# EAGLE design Enclosure 100x68 WS (EAGLE 9.6.2)
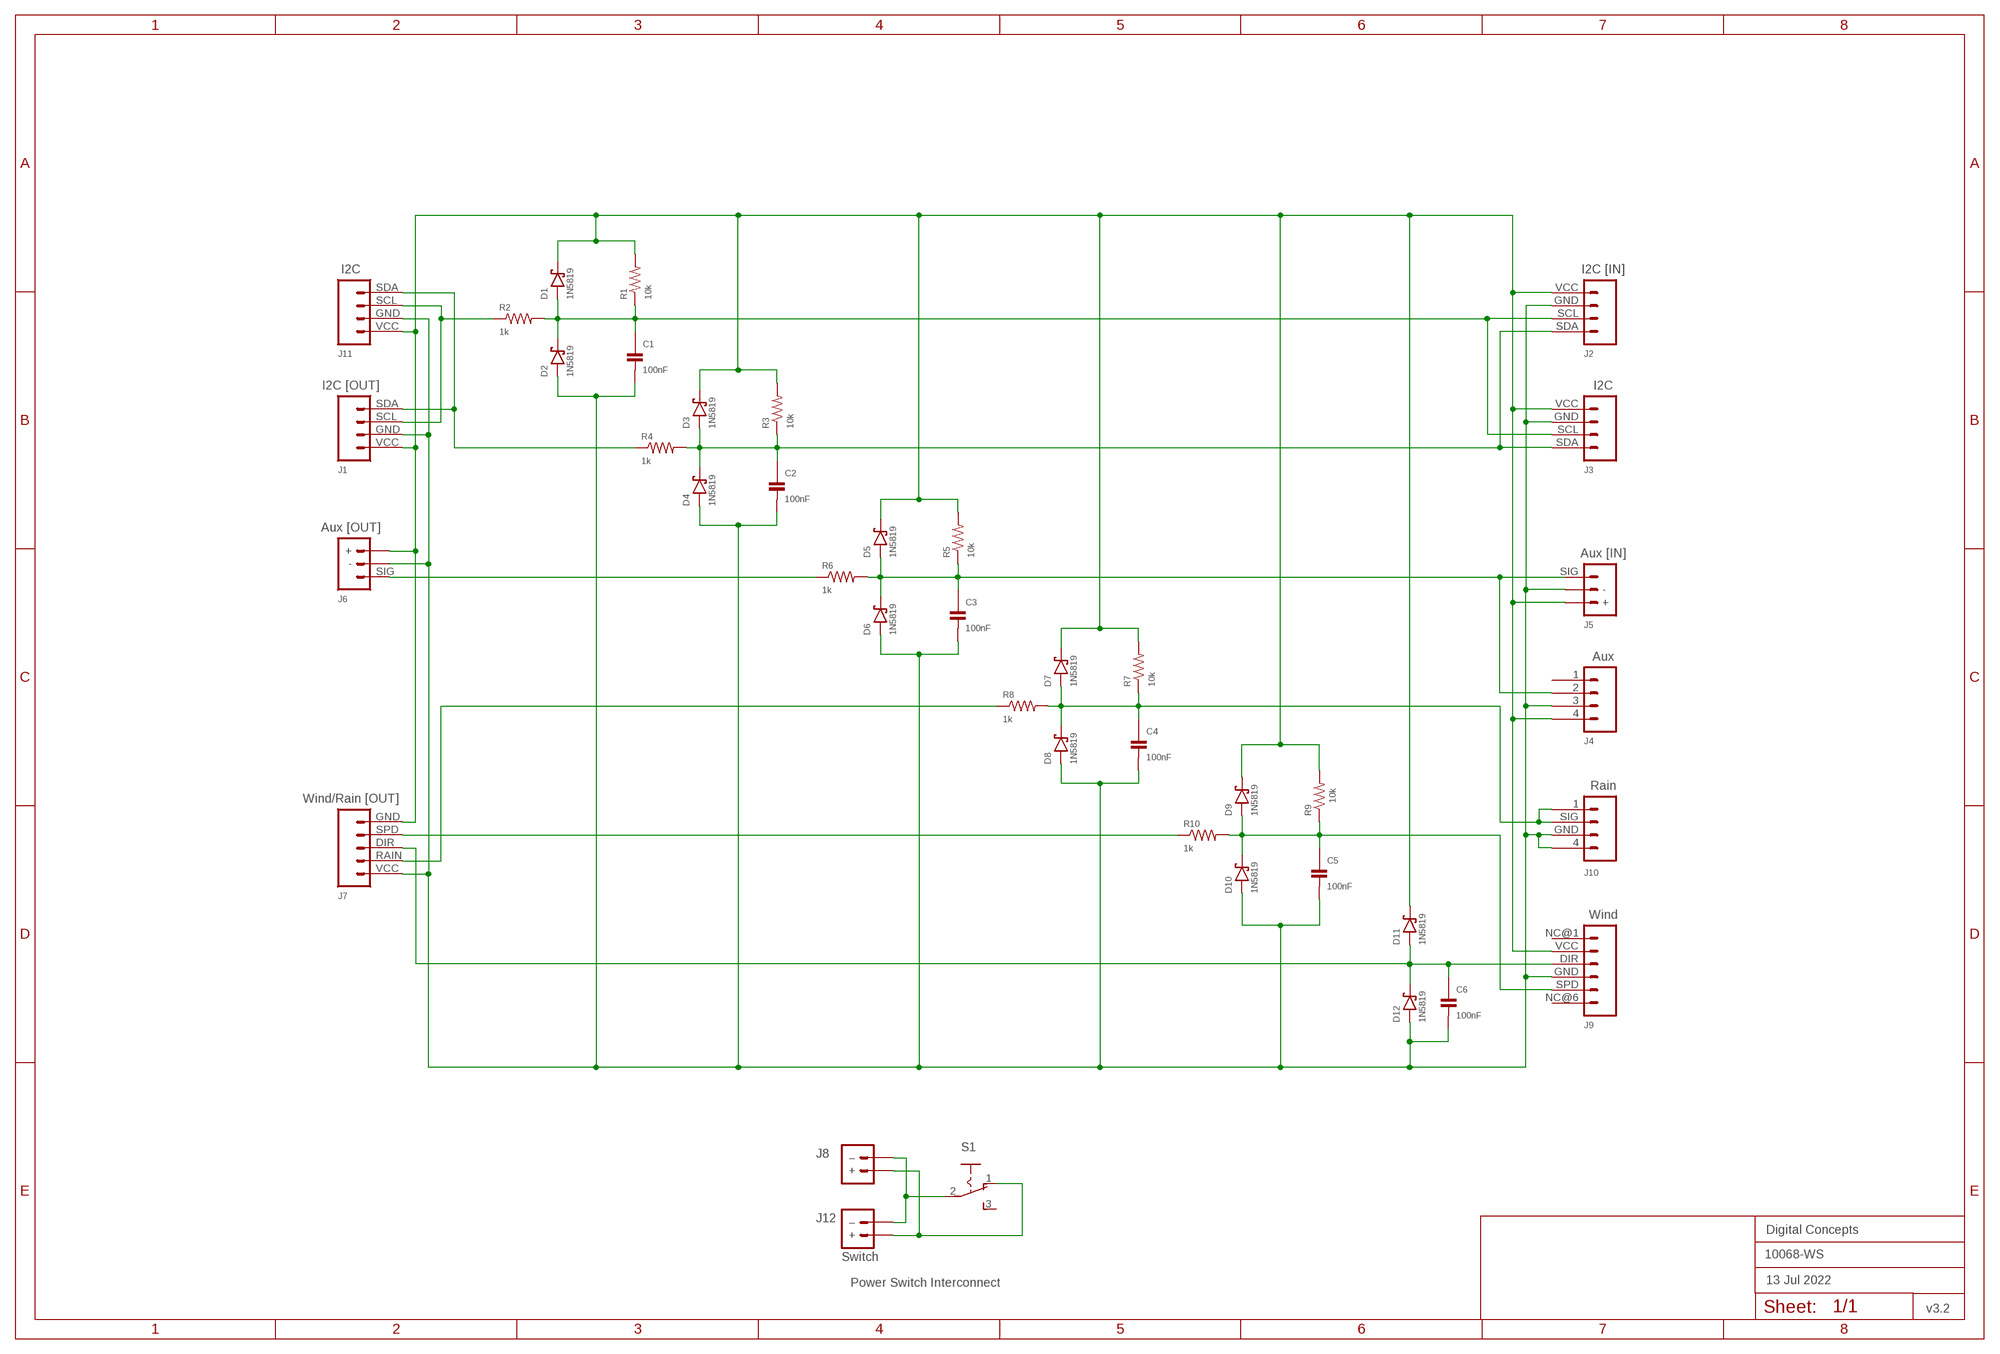
[diagram p0: schematic, sheet 1]
FRAME2 (A3L-LOC): DATE: 13 Jul 2022; OWNER: Digital Concepts; TITLE: 10068-WS; VERSION: v3.2

## Parts
C1  100nF  CAPACITOR-0805  [C0805]
C2  100nF  CAPACITOR-0805  [C0805]
C3  100nF  CAPACITOR-0805  [C0805]
C4  100nF  CAPACITOR-0805  [C0805]
C5  100nF  CAPACITOR-0805  [C0805]
C6  100nF  CAPACITOR-0805  [C0805]
D1  1N5819  DIODE-SCHOTTKY-1N5819  [SOD-123]
D2  1N5819  DIODE-SCHOTTKY-1N5819  [SOD-123]
D3  1N5819  DIODE-SCHOTTKY-1N5819  [SOD-123]
D4  1N5819  DIODE-SCHOTTKY-1N5819  [SOD-123]
D5  1N5819  DIODE-SCHOTTKY-1N5819  [SOD-123]
D6  1N5819  DIODE-SCHOTTKY-1N5819  [SOD-123]
D7  1N5819  DIODE-SCHOTTKY-1N5819  [SOD-123]
D8  1N5819  DIODE-SCHOTTKY-1N5819  [SOD-123]
D9  1N5819  DIODE-SCHOTTKY-1N5819  [SOD-123]
D10  1N5819  DIODE-SCHOTTKY-1N5819  [SOD-123]
D11  1N5819  DIODE-SCHOTTKY-1N5819  [SOD-123]
D12  1N5819  DIODE-SCHOTTKY-1N5819  [SOD-123]
J1  I2C [OUT]  JST-PH2.0-4-DUAL-I2C  [JST-PH2.0-4-DUAL-I2C]
J2  I2C [IN]  JST-PH2.0-4-VERTICAL-I2C  [JST-PH2.0-4-VERTICAL-I2C]
J3  I2C  RJ11-6P4C-VERTICAL-I2C  [RJ11-4-VERTICAL-I2C]
J4  Aux  RJ11-6P4C-VERTICAL  [RJ11-4-VERTICAL]
J5  Aux [IN]  JST-PH2.0-3-VERTICAL-SIG  [JST-PH2.0-3-VERTICAL-SIG]
J6  Aux [OUT]  JST-PH2.0-3-DUAL-SIG  [JST-PH2.0-3-DUAL-SIG]
J7  Wind/Rain [OUT]  JST-PH2.0-5-DUAL-WEATHER  [JST-PH2.0-5-DUAL-WEATHER]
J8  Switch  JST-PH2.0-2-VERTICAL-POWER  [JST-PH2.0-2-VERTICAL=POWER]
J9  Wind  RJ11-6P6C-VERTICAL-WIND  [RJ11-6-VERTICAL-WIND]
J10  Rain  RJ11-6P4C-VERTICAL-RAIN  [RJ11-4-VERTICAL-RAIN]
J11  I2C  HEADER-1X4-I2C  [CONN_04-I2C]
J12  Switch  JST-PH2.0-2-HORIZONTAL-POWERJST-PTH-2  [JST-PH2.0-2-HORIZONTAL-POWER]
R1  10k  RESISTORR0805  [R0805]
R2  1k  RESISTORR0805  [R0805]
R3  10k  RESISTORR0805  [R0805]
R4  1k  RESISTORR0805  [R0805]
R5  10k  RESISTORR0805  [R0805]
R6  1k  RESISTORR0805  [R0805]
R7  10k  RESISTORR0805  [R0805]
R8  1k  RESISTORR0805  [R0805]
R9  10k  RESISTORR0805  [R0805]
R10  1k  RESISTORR0805  [R0805]
S1  SWITCH-SLIDE-SPDT  [SWITCH-SPDT-PTH]

## Nets
GND: C1.2 C2.2 C3.2 C4.2 C5.2 C6.2 D2.A D4.A D6.A D8.A D10.A D12.A J1.GND J2.GND J3.GND J4.3 J5.- J6.- J7.VCC J9.GND J10.4 J10.GND J11.GND
N$1: J7.RAIN R8.1
N$2: J1.SCL J11.SCL R2.1
N$3: J1.SDA J11.SDA R4.1
N$4: C6.1 D11.A D12.C J7.DIR J9.DIR
N$5: J7.SPD R10.1
N$7: C4.1 D7.A D8.C J10.1 J10.SIG R7.1 R8.2
N$8: C2.1 D3.A D4.C J2.SDA J3.SDA R3.1 R4.2
N$9: J6.SIG R6.1
N$11: C1.1 D1.A D2.C J2.SCL J3.SCL R1.1 R2.2
N$14: J8.-(–) J12.-(–) S1.2(P)
N$15: C3.1 D5.A D6.C J4.2 J5.SIG R5.1 R6.2
N$16: J8.+ J12.+ S1.1(O)
N$29: C5.1 D9.A D10.C J9.SPD R9.1 R10.2
VCC: D1.C D3.C D5.C D7.C D9.C D11.C J1.VCC J2.VCC J3.VCC J4.4 J5.+ J6.+ J7.GND J9.VCC J11.VCC R1.2 R3.2 R5.2 R7.2 R9.2
Unconnected: J4.1 J9.NC@1 J9.NC@6 S1.3(S)

## Notes on the sheet
- Power Switch Interconnect

## Library data of the parts
C1-C6 = digitalconcepts:CAPACITOR-0805: 0805 Capacitor
D1-D12 = digitalconcepts:DIODE-SCHOTTKY-1N5819: 1N5819 Schottky Diode SOD-123
J1 = digitalconcepts:JST-PH2.0-4-DUAL-I2C: PH2.0 4P I2C Dual Connector
J2 = digitalconcepts:JST-PH2.0-4-VERTICAL-I2C: PH2.0 4P I2C Vertical Connector
J3 = digitalconcepts:RJ11-6P4C-VERTICAL-I2C: RJ11-6P4C-Vertical PCB Socket
J4 = digitalconcepts:RJ11-6P4C-VERTICAL: RJ11-6P4C-Vertical PCB Socket
J5 = digitalconcepts:JST-PH2.0-3-VERTICAL-SIG: PH2.0 3P Vertical Connector (Sig)
J6 = digitalconcepts:JST-PH2.0-3-DUAL-SIG: PH2.0 3P Dual Sig Horizontal on top, vertical on bottom
J7 = digitalconcepts:JST-PH2.0-5-DUAL-WEATHER: PH2.0 5P Dual Connector
J8 = digitalconcepts:JST-PH2.0-2-VERTICAL-POWER: JST PH2.0 2P PTH Connector (Power)
J9 = digitalconcepts:RJ11-6P6C-VERTICAL-WIND: RJ11-6P6C-Vertical PCB Socket
J10 = digitalconcepts:RJ11-6P4C-VERTICAL-RAIN: RJ11-6P4C-Vertical PCB Socket
J11 = digitalconcepts:HEADER-1X4-I2C: I2C Interface [Pin 1 Vcc] 4-Pin Header
J12 = digitalconcepts:JST-PH2.0-2-HORIZONTAL-POWER: PH2.0 2P Right Angle PCB Connector; PROD_ID: CONN-09863; SKU: PRT-09914
R1-R10 = digitalconcepts:RESISTOR: Resistor; SPICEPREFIX: R
S1 = digitalconcepts:SWITCH-SLIDE-SPDT: Mini Sliding Switch SPDT

## Board
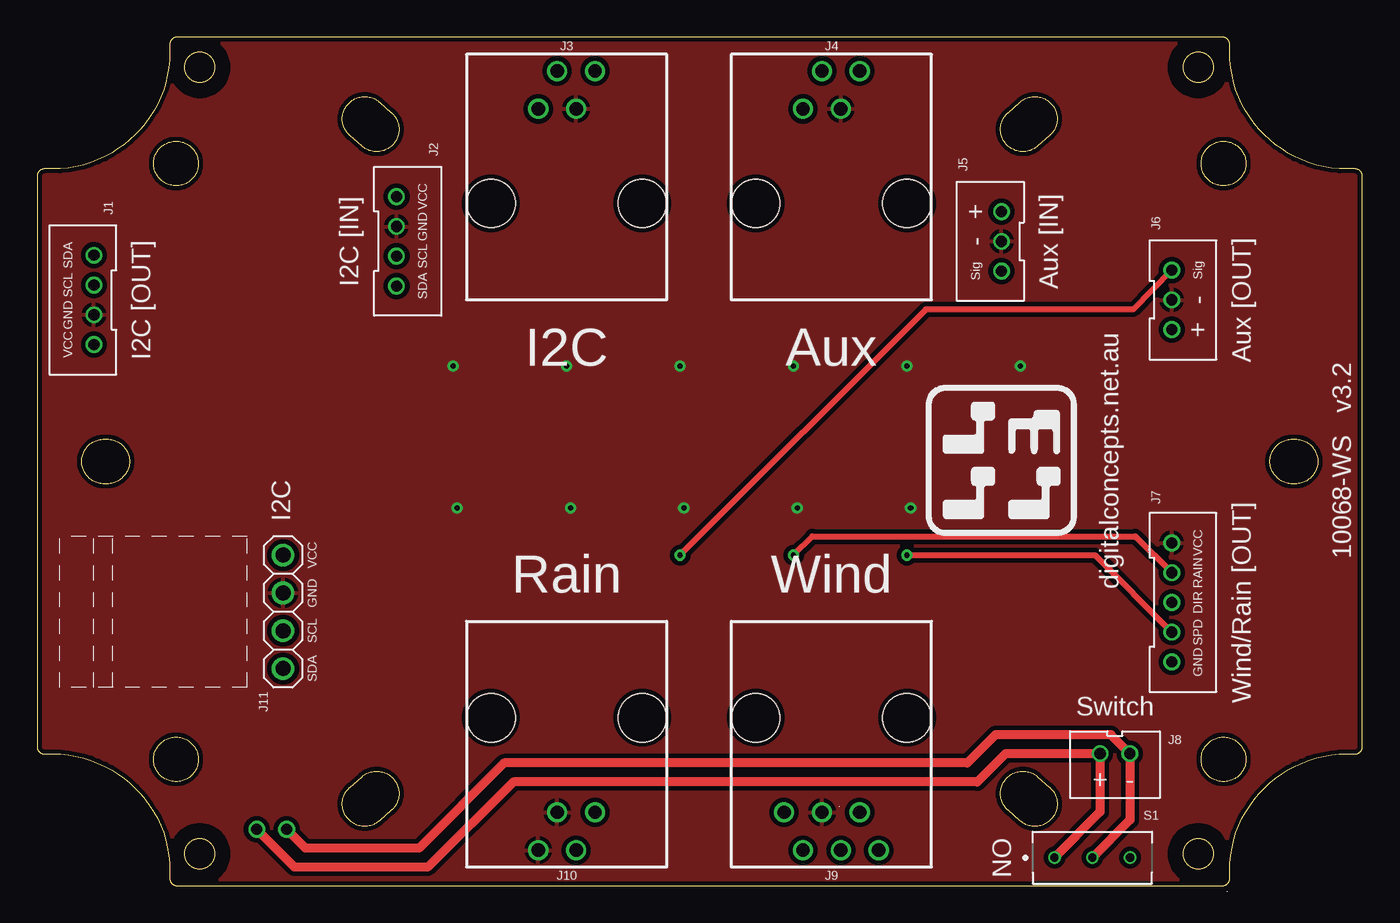
[diagram p1: board, top side]
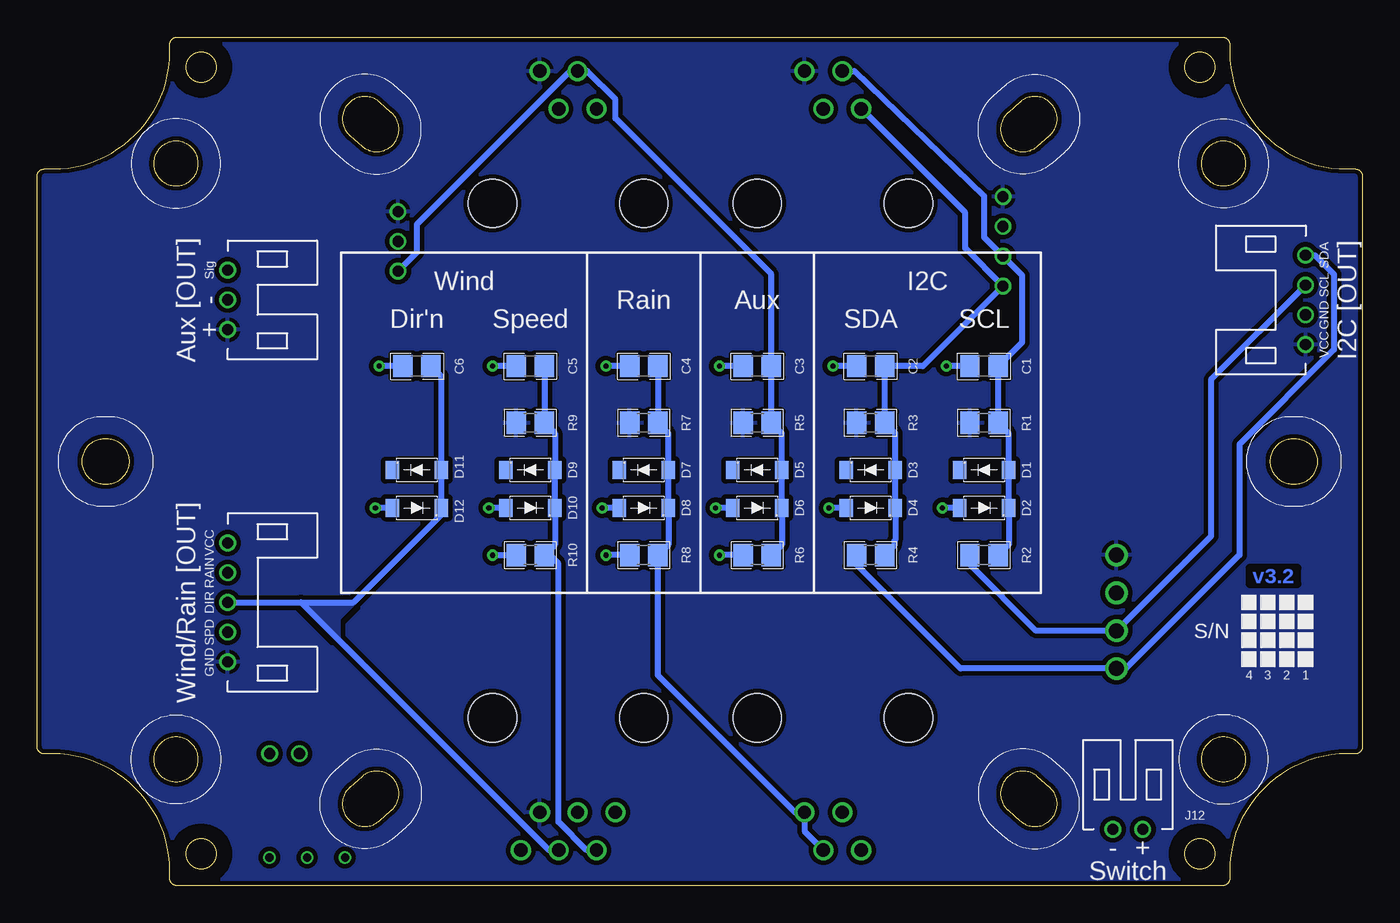
[diagram p2: board, bottom side, seen from below]

Size 89 x 57 mm. Coordinates in mm from the lower left corner, seen from the top.
Outline: 65.22,5.06 66.02,4.36 66.02,4.36 66.06,4.32 66.11,4.28 66.17,4.24 66.25,4.19 66.33,4.14 66.42,4.11 66.51,4.07 66.6,4.04 66.7,4.02 66.8,4 66.9,3.99 67.11,3.99 67.21,4 67.31,4.02 67.4,4.04 67.5,4.07 67.59,4.11 67.68,4.14 67.76,4.19 67.84,4.24 67.92,4.3 68,4.36 68.07,4.43 68.13,4.49 68.19,4.57 68.25,4.65 68.3,4.73 68.35,4.81 68.39,4.9 68.42,4.99 68.45,5.09 68.47,5.19 68.49,5.28 68.5,5.38 68.5,5.59 68.49,5.69 68.47,5.79 68.45,5.89 68.42,5.98 68.39,6.07 68.35,6.16 68.3,6.25 68.25,6.33 68.19,6.41 68.13,6.48 68.07,6.55 68.04,6.57 68.02,6.59 67.99,6.62 67.99,6.62 67.19,7.32 67.19,7.32 67.14,7.36 67.09,7.4 67.04,7.43 66.96,7.49 66.88,7.53 66.79,7.57 66.7,7.61 66.6,7.64 66.51,7.66 66.41,7.68 66.31,7.69 66.1,7.69 66,7.68 65.9,7.66 65.8,7.64 65.71,7.61 65.62,7.57 65.53,7.53 65.45,7.49 65.37,7.43 65.29,7.38 65.21,7.32 65.14,7.25 65.08,7.18 65.01,7.11 64.96,7.03 64.91,6.95 64.86,6.86 64.82,6.77 64.78,6.68 64.75,6.59 64.74,6.49 64.72,6.39 64.7,6.29 64.7,6.08 64.72,5.98 64.74,5.89 64.75,5.79 64.78,5.69 64.82,5.6 64.86,5.51 64.91,5.43 64.96,5.35 65.01,5.27 65.08,5.2 65.17,5.1 65.19,5.08 65.22,5.06
Outline: 65.22,5.06 65.22,5.06
Outline: 65.22,51.94 65.19,51.92 65.17,51.9 65.14,51.87 65.08,51.8 65.01,51.73 64.96,51.65 64.91,51.57 64.86,51.49 64.82,51.4 64.78,51.31 64.75,51.21 64.73,51.11 64.71,51.02 64.7,50.92 64.7,50.71 64.71,50.61 64.73,50.51 64.75,50.41 64.78,50.32 64.82,50.23 64.86,50.14 64.91,50.05 64.96,49.97 65.01,49.89 65.08,49.82 65.14,49.75 65.21,49.68 65.29,49.62 65.37,49.57 65.45,49.51 65.53,49.47 65.62,49.43 65.71,49.39 65.8,49.36 65.9,49.34 66,49.32 66.1,49.31 66.31,49.31 66.41,49.32 66.51,49.34 66.6,49.36 66.7,49.39 66.79,49.43 66.88,49.47 66.96,49.51 67.04,49.57 67.09,49.6 67.14,49.64 67.19,49.68 67.19,49.68 67.99,50.38 67.99,50.38 68.02,50.41 68.04,50.43 68.07,50.45 68.13,50.52 68.19,50.59 68.25,50.67 68.3,50.75 68.35,50.84 68.39,50.93 68.42,51.02 68.45,51.11 68.47,51.21 68.49,51.31 68.5,51.41 68.5,51.62 68.49,51.72 68.45,51.91 68.42,52.01 68.39,52.1 68.35,52.19 68.3,52.27 68.25,52.35 68.19,52.43 68.13,52.51 68.07,52.57 68,52.64 67.92,52.7 67.84,52.76 67.76,52.81 67.68,52.86 67.59,52.89 67.5,52.93 67.4,52.96 67.31,52.98 67.21,53 67.11,53.01 66.9,53.01 66.8,53 66.7,52.98 66.6,52.96 66.51,52.93 66.42,52.89 66.33,52.86 66.25,52.81 66.17,52.76 66.11,52.72 66.06,52.68 66.02,52.64 66.02,52.64 65.22,51.94
Outline: 65.22,51.94 65.22,51.94
Outline: 23.78,5.06 23.81,5.08 23.83,5.1 23.86,5.13 23.92,5.2 23.99,5.27 24.04,5.35 24.09,5.43 24.14,5.51 24.18,5.6 24.22,5.69 24.25,5.79 24.27,5.89 24.29,5.98 24.3,6.08 24.3,6.29 24.29,6.39 24.27,6.49 24.25,6.59 24.22,6.68 24.18,6.77 24.14,6.86 24.09,6.95 24.04,7.03 23.99,7.11 23.92,7.18 23.86,7.25 23.79,7.32 23.71,7.38 23.63,7.43 23.55,7.49 23.47,7.53 23.38,7.57 23.29,7.61 23.2,7.64 23.1,7.66 23,7.68 22.9,7.69 22.69,7.69 22.59,7.68 22.49,7.66 22.4,7.64 22.3,7.61 22.21,7.57 22.12,7.53 22.04,7.49 21.96,7.43 21.91,7.4 21.86,7.36 21.81,7.32 21.81,7.32 21.01,6.62 21.01,6.62 20.98,6.59 20.96,6.57 20.94,6.55 20.87,6.48 20.81,6.41 20.75,6.33 20.7,6.25 20.65,6.16 20.61,6.07 20.58,5.98 20.55,5.89 20.53,5.79 20.51,5.69 20.5,5.59 20.5,5.38 20.51,5.28 20.53,5.18 20.55,5.09 20.58,4.99 20.61,4.9 20.65,4.81 20.7,4.73 20.75,4.65 20.81,4.57 20.87,4.49 20.94,4.43 21,4.36 21.08,4.3 21.16,4.24 21.24,4.19 21.32,4.14 21.41,4.11 21.5,4.07 21.6,4.04 21.69,4.02 21.79,4 21.89,3.99 22.1,3.99 22.2,4 22.3,4.02 22.4,4.04 22.49,4.07 22.58,4.11 22.67,4.14 22.75,4.19 22.83,4.24 22.89,4.28 22.94,4.32 22.98,4.36 22.98,4.36 23.78,5.06
Outline: 23.78,5.06 23.78,5.06
Outline: 21.01,50.38 21.81,49.68 21.81,49.68 21.86,49.64 21.91,49.6 21.96,49.57 22.04,49.51 22.12,49.47 22.21,49.43 22.3,49.39 22.4,49.36 22.49,49.34 22.59,49.32 22.69,49.31 22.9,49.31 23,49.32 23.1,49.34 23.2,49.36 23.29,49.39 23.38,49.43 23.47,49.47 23.56,49.51 23.64,49.57 23.71,49.62 23.79,49.68 23.86,49.75 23.93,49.82 23.99,49.89 24.04,49.97 24.09,50.05 24.14,50.14 24.18,50.23 24.22,50.32 24.25,50.41 24.27,50.51 24.29,50.61 24.3,50.71 24.3,50.91 24.29,51.02 24.27,51.11 24.25,51.21 24.22,51.31 24.18,51.4 24.14,51.48 24.09,51.57 24.04,51.65 23.99,51.73 23.93,51.8 23.86,51.87 23.83,51.9 23.81,51.92 23.78,51.94 23.78,51.94 22.98,52.64 22.98,52.64 22.93,52.68 22.89,52.72 22.83,52.76 22.75,52.81 22.67,52.86 22.58,52.89 22.49,52.93 22.4,52.96 22.3,52.98 22.2,53 22.1,53.01 21.89,53.01 21.79,53 21.69,52.98 21.6,52.96 21.5,52.93 21.41,52.89 21.32,52.86 21.24,52.81 21.16,52.76 21.08,52.7 21,52.64 20.94,52.57 20.87,52.51 20.81,52.43 20.75,52.35 20.7,52.27 20.65,52.19 20.61,52.1 20.58,52.01 20.55,51.91 20.53,51.81 20.51,51.72 20.5,51.62 20.5,51.41 20.51,51.31 20.53,51.21 20.55,51.11 20.58,51.02 20.61,50.93 20.65,50.84 20.7,50.75 20.75,50.67 20.81,50.59 20.87,50.52 20.94,50.45 20.96,50.43 20.98,50.41 21.01,50.38
Outline: 21.01,50.38 21.01,50.38
Outline: 0.01,9.24 0.02,9.2 0.03,9.17 0.04,9.14 0.05,9.11 0.07,9.09 0.08,9.06 0.1,9.03 0.12,9.01 0.14,8.99 0.17,8.97 0.19,8.95 0.22,8.93 0.24,8.91 0.27,8.9 0.3,8.88 0.33,8.87 0.36,8.86 0.39,8.85 0.43,8.85 0.46,8.84 1.54,8.84 2.07,8.79 2.58,8.68 3.1,8.58 3.6,8.43 4.07,8.23 4.54,8.03 4.99,7.78 5.41,7.5 5.83,7.22 6.23,6.9 6.58,6.54 6.94,6.19 7.26,5.8 7.55,5.38 7.83,4.96 8.08,4.51 8.48,3.57 8.63,3.08 8.74,2.57 8.85,2.05 8.9,1.53 8.9,0.46 8.9,0.42 8.91,0.39 8.92,0.36 8.93,0.33 8.94,0.3 8.95,0.27 8.97,0.24 8.98,0.22 9,0.19 9.02,0.17 9.04,0.14 9.07,0.12 9.09,0.1 9.12,0.08 9.14,0.07 9.17,0.05 9.2,0.04 9.23,0.03 9.26,0.02 9.3,0.01 9.33,0 9.36,0 79.64,0 79.67,0 79.7,0.01 79.74,0.02 79.77,0.03 79.8,0.04 79.83,0.05 79.86,0.07 79.88,0.08 79.91,0.1 79.93,0.12 79.98,0.17 80,0.19 80.02,0.22 80.03,0.24 80.05,0.27 80.06,0.3 80.07,0.33 80.08,0.36 80.09,0.39 80.1,0.42 80.1,0.46 80.1,1.53 80.16,2.05 80.26,2.57 80.37,3.08 80.52,3.57 80.72,4.04 80.92,4.51 81.17,4.96 81.45,5.38 81.74,5.8 82.06,6.19 82.42,6.54 82.78,6.9 83.17,7.22 83.59,7.5 84.01,7.78 84.46,8.03 84.93,8.23 85.41,8.43 85.9,8.58 86.42,8.68 86.93,8.79 87.46,8.84 88.54,8.84 88.57,8.85 88.61,8.85 88.64,8.86 88.67,8.87 88.7,8.88 88.73,8.9 88.76,8.91 88.78,8.93 88.81,8.95 88.83,8.97 88.86,8.99 88.88,9.01 88.9,9.03 88.92,9.06 88.93,9.09 88.95,9.11 88.96,9.14 88.97,9.17 88.98,9.2 88.99,9.24 89,9.27 89,9.3 89,47.7 89,47.73 88.99,47.76 88.98,47.79 88.97,47.83 88.96,47.86 88.95,47.88 88.93,47.91 88.92,47.94 88.9,47.96 88.88,47.99 88.86,48.01 88.83,48.03 88.81,48.05 88.78,48.07 88.76,48.09 88.73,48.1 88.7,48.12 88.67,48.13 88.64,48.14 88.61,48.14 88.57,48.15 88.54,48.15 87.46,48.15 86.93,48.21 86.42,48.31 85.9,48.42 85.41,48.57 84.93,48.77 84.46,48.97 84.01,49.22 83.59,49.5 83.17,49.78 82.78,50.1 82.42,50.46 82.06,50.81 81.74,51.2 81.45,51.62 81.17,52.04 80.92,52.49 80.72,52.96 80.52,53.43 80.37,53.92 80.26,54.43 80.16,54.94 80.1,55.47 80.1,56.54 80.1,56.58 80.09,56.61 80.08,56.64 80.07,56.67 80.06,56.7 80.05,56.73 80.03,56.76 80.02,56.78 80,56.81 79.98,56.83 79.96,56.86 79.93,56.88 79.91,56.9 79.88,56.92 79.86,56.93 79.83,56.95 79.8,56.96 79.77,56.97 79.74,56.98 79.71,56.99 79.67,57 79.64,57 9.36,57 9.33,57 9.3,56.99 9.26,56.98 9.23,56.97 9.2,56.96 9.17,56.95 9.14,56.93 9.12,56.92 9.09,56.9 9.07,56.88 9.04,56.86 9.02,56.83 9,56.81 8.98,56.78 8.97,56.76 8.95,56.73 8.94,56.7 8.93,56.67 8.92,56.64 8.91,56.61 8.9,56.58 8.9,56.54 8.9,55.47 8.85,54.94 8.74,54.43 8.63,53.92 8.48,53.43 8.08,52.49 7.83,52.04 7.55,51.62 7.26,51.2 6.94,50.81 6.58,50.46 6.23,50.1 5.83,49.78 5.41,49.5 4.99,49.22 4.54,48.97 4.07,48.77 3.6,48.57 3.1,48.42 2.58,48.31 2.07,48.21 1.54,48.15 0.46,48.15 0.43,48.15 0.39,48.14 0.36,48.14 0.33,48.13 0.3,48.12 0.27,48.1 0.24,48.09 0.22,48.07 0.19,48.05 0.17,48.03 0.14,48.01 0.12,47.99 0.1,47.96 0.08,47.94 0.07,47.91 0.05,47.88 0.04,47.85 0.03,47.83 0.02,47.79 0.01,47.76 0,47.73 0,47.7 0,9.3 0,9.27 0.01,9.24
Outline: 82.84,28.8 82.86,28.9 82.88,28.99 82.92,29.08 82.96,29.17 83.01,29.26 83.06,29.34 83.12,29.42 83.18,29.49 83.24,29.56 83.31,29.63 83.39,29.69 83.47,29.74 83.55,29.8 83.63,29.84 83.72,29.88 83.81,29.92 83.91,29.95 84,29.97 84.1,29.99 84.2,30 84.61,30 84.71,29.99 84.81,29.97 84.91,29.95 85,29.92 85.09,29.88 85.18,29.84 85.26,29.8 85.34,29.74 85.42,29.69 85.5,29.63 85.57,29.56 85.63,29.49 85.7,29.42 85.75,29.34 85.8,29.26 85.85,29.17 85.89,29.08 85.93,28.99 85.96,28.9 85.98,28.8 85.99,28.7 86.01,28.6 86.01,28.4 85.99,28.3 85.98,28.2 85.96,28.1 85.93,28.01 85.85,27.83 85.8,27.74 85.75,27.66 85.7,27.58 85.63,27.51 85.57,27.44 85.5,27.37 85.42,27.31 85.34,27.26 85.26,27.2 85.18,27.16 85.09,27.12 85,27.08 84.91,27.05 84.81,27.03 84.71,27.01 84.61,27 84.2,27 84.1,27.01 84,27.03 83.91,27.05 83.81,27.08 83.72,27.12 83.63,27.16 83.55,27.2 83.47,27.26 83.39,27.31 83.31,27.37 83.24,27.44 83.18,27.51 83.12,27.58 83.06,27.66 83.01,27.74 82.96,27.83 82.92,27.92 82.88,28.01 82.86,28.1 82.84,28.2 82.82,28.3 82.81,28.4 82.81,28.6 82.82,28.7 82.84,28.8
Outline: 78.21,48.82 78.23,48.91 78.26,49.01 78.3,49.1 78.34,49.19 78.38,49.27 78.44,49.35 78.49,49.43 78.55,49.51 78.62,49.58 78.69,49.64 78.76,49.7 78.84,49.76 78.92,49.81 79.01,49.86 79.1,49.9 79.19,49.94 79.28,49.96 79.38,49.98 79.47,50 79.58,50.02 79.78,50.02 79.88,50 79.98,49.98 80.08,49.96 80.17,49.94 80.26,49.9 80.35,49.86 80.44,49.81 80.52,49.76 80.6,49.7 80.67,49.64 80.74,49.58 80.81,49.51 80.87,49.43 80.92,49.35 80.98,49.27 81.02,49.19 81.06,49.1 81.1,49.01 81.13,48.91 81.15,48.82 81.17,48.72 81.18,48.62 81.18,48.41 81.17,48.31 81.15,48.21 81.13,48.11 81.1,48.02 81.06,47.93 81.02,47.84 80.98,47.76 80.92,47.68 80.87,47.6 80.81,47.52 80.74,47.45 80.67,47.39 80.6,47.33 80.52,47.27 80.44,47.22 80.35,47.17 80.26,47.13 80.17,47.09 80.08,47.07 79.98,47.05 79.88,47.03 79.78,47.02 79.58,47.02 79.47,47.03 79.38,47.05 79.28,47.07 79.19,47.09 79.1,47.13 79.01,47.17 78.92,47.22 78.84,47.27 78.76,47.33 78.69,47.39 78.62,47.45 78.55,47.52 78.49,47.6 78.44,47.68 78.38,47.76 78.34,47.84 78.3,47.93 78.26,48.02 78.23,48.11 78.21,48.21 78.19,48.31 78.18,48.41 78.18,48.62 78.19,48.72 78.21,48.82
Outline: 78.21,8.79 78.23,8.89 78.26,8.98 78.3,9.07 78.34,9.16 78.38,9.24 78.44,9.32 78.49,9.4 78.55,9.48 78.62,9.55 78.69,9.61 78.76,9.67 78.84,9.73 78.92,9.78 79.01,9.83 79.1,9.87 79.19,9.9 79.28,9.93 79.38,9.95 79.47,9.97 79.58,9.98 79.78,9.98 79.88,9.97 79.98,9.95 80.08,9.93 80.17,9.9 80.26,9.87 80.35,9.83 80.44,9.78 80.52,9.73 80.6,9.67 80.67,9.61 80.74,9.55 80.81,9.48 80.87,9.4 80.92,9.32 80.98,9.24 81.02,9.16 81.06,9.07 81.1,8.98 81.13,8.89 81.15,8.79 81.17,8.69 81.18,8.59 81.18,8.38 81.17,8.28 81.15,8.18 81.13,8.09 81.1,7.99 81.06,7.9 81.02,7.81 80.98,7.73 80.92,7.65 80.87,7.57 80.81,7.49 80.74,7.42 80.67,7.36 80.6,7.29 80.52,7.24 80.44,7.19 80.35,7.14 80.26,7.1 80.17,7.06 80.08,7.03 79.98,7.01 79.88,7 79.78,6.98 79.58,6.98 79.47,7 79.38,7.01 79.28,7.03 79.19,7.06 79.1,7.1 79.01,7.14 78.92,7.19 78.84,7.24 78.76,7.29 78.69,7.36 78.62,7.42 78.55,7.49 78.49,7.57 78.44,7.65 78.38,7.73 78.34,7.81 78.3,7.9 78.26,7.99 78.23,8.09 78.21,8.18 78.19,8.28 78.18,8.38 78.18,8.59 78.19,8.69 78.21,8.79
Outline: 7.85,48.82 7.87,48.91 7.9,49.01 7.94,49.1 7.98,49.19 8.02,49.27 8.08,49.35 8.13,49.43 8.19,49.51 8.26,49.58 8.33,49.64 8.4,49.7 8.48,49.76 8.56,49.81 8.65,49.86 8.74,49.9 8.83,49.93 8.92,49.96 9.02,49.98 9.12,50 9.22,50.01 9.42,50.01 9.53,50 9.62,49.98 9.72,49.96 9.82,49.93 9.9,49.9 10,49.86 10.08,49.81 10.16,49.76 10.24,49.7 10.31,49.64 10.38,49.58 10.45,49.51 10.51,49.43 10.57,49.35 10.62,49.27 10.67,49.19 10.7,49.1 10.74,49.01 10.77,48.91 10.79,48.82 10.81,48.72 10.82,48.62 10.82,48.41 10.81,48.31 10.79,48.21 10.77,48.11 10.74,48.02 10.7,47.93 10.67,47.84 10.62,47.76 10.57,47.68 10.51,47.6 10.45,47.52 10.38,47.45 10.31,47.39 10.24,47.33 10.16,47.27 10.08,47.22 10,47.17 9.9,47.13 9.82,47.1 9.72,47.07 9.62,47.05 9.53,47.03 9.42,47.02 9.22,47.02 9.12,47.03 9.02,47.05 8.92,47.07 8.83,47.1 8.74,47.13 8.65,47.17 8.56,47.22 8.48,47.27 8.4,47.33 8.33,47.39 8.26,47.45 8.19,47.52 8.13,47.6 8.08,47.68 8.02,47.76 7.98,47.84 7.94,47.93 7.9,48.02 7.87,48.11 7.85,48.21 7.83,48.31 7.82,48.41 7.82,48.62 7.83,48.72 7.85,48.82
Outline: 7.85,8.79 7.87,8.88 7.9,8.98 7.94,9.07 7.98,9.16 8.02,9.24 8.08,9.32 8.13,9.4 8.19,9.48 8.26,9.54 8.33,9.61 8.4,9.67 8.48,9.73 8.56,9.78 8.65,9.83 8.74,9.87 8.83,9.9 8.92,9.93 9.02,9.95 9.12,9.97 9.22,9.98 9.42,9.98 9.53,9.97 9.62,9.95 9.72,9.93 9.82,9.9 9.9,9.87 10,9.83 10.08,9.78 10.16,9.73 10.24,9.67 10.31,9.61 10.38,9.54 10.45,9.48 10.51,9.4 10.57,9.32 10.62,9.24 10.67,9.16 10.7,9.07 10.74,8.98 10.77,8.88 10.79,8.79 10.81,8.69 10.82,8.59 10.82,8.38 10.81,8.28 10.79,8.18 10.77,8.09 10.74,7.99 10.7,7.9 10.67,7.81 10.62,7.73 10.57,7.65 10.51,7.57 10.45,7.49 10.38,7.42 10.31,7.36 10.24,7.29 10.16,7.24 10.08,7.19 10,7.14 9.9,7.1 9.82,7.06 9.72,7.04 9.62,7.02 9.53,7 9.42,6.98 9.22,6.98 9.12,7 9.02,7.02 8.92,7.04 8.83,7.06 8.74,7.1 8.65,7.14 8.56,7.19 8.48,7.24 8.4,7.29 8.33,7.36 8.26,7.42 8.19,7.49 8.13,7.57 8.08,7.65 8.02,7.73 7.98,7.81 7.94,7.9 7.9,7.99 7.87,8.09 7.85,8.18 7.83,8.28 7.82,8.38 7.82,8.59 7.83,8.69 7.85,8.79
Outline: 3.03,28.8 3.05,28.9 3.07,28.99 3.11,29.08 3.15,29.17 3.2,29.26 3.25,29.34 3.31,29.42 3.37,29.49 3.43,29.56 3.5,29.63 3.58,29.69 3.66,29.74 3.74,29.8 3.82,29.84 3.91,29.88 4,29.92 4.1,29.95 4.19,29.97 4.29,29.99 4.39,30 4.8,30 4.9,29.99 5,29.97 5.1,29.95 5.19,29.92 5.28,29.88 5.37,29.84 5.45,29.8 5.53,29.74 5.61,29.69 5.69,29.63 5.76,29.56 5.82,29.49 5.89,29.42 5.94,29.34 5.99,29.26 6.04,29.17 6.08,29.08 6.12,28.99 6.15,28.9 6.17,28.8 6.18,28.7 6.2,28.6 6.2,28.4 6.18,28.3 6.17,28.2 6.15,28.1 6.12,28.01 6.08,27.92 6.04,27.83 5.99,27.74 5.94,27.66 5.89,27.58 5.82,27.51 5.76,27.44 5.69,27.37 5.61,27.31 5.53,27.26 5.45,27.2 5.37,27.16 5.28,27.12 5.19,27.08 5.1,27.05 5,27.03 4.9,27.01 4.8,27 4.39,27 4.29,27.01 4.19,27.03 4.1,27.05 4,27.08 3.91,27.12 3.82,27.16 3.74,27.2 3.66,27.26 3.58,27.31 3.5,27.37 3.43,27.44 3.37,27.51 3.31,27.58 3.25,27.66 3.2,27.74 3.15,27.83 3.11,27.92 3.07,28.01 3.05,28.1 3.03,28.2 3.01,28.3 3,28.4 3,28.6 3.01,28.7 3.03,28.8
Outline: circle at 77.98,2.14 radius 1.02
Outline: circle at 10.92,2.14 radius 1.02
Outline: circle at 10.92,54.97 radius 1.02
Outline: circle at 77.98,54.97 radius 1.02
Copper layers (1*16): Top 0.035mm / dielectric 1.5mm / Bottom 0.035mm
Design rules "default *": minimum track width 6mil, minimum drill 0.35mm, track to track 6mil, track to pad 6mil, pad to pad 6mil, via to via 6mil, smd to smd 6mil, copper to edge 6mil, drill to drill 6mil, minimum pad ring 1mil, minimum via ring 8mil, stop-mask expansion 4mil, vias tented up to drill 0mil, thermal gap 10mil

### Footprints (pad centres in the part's own frame; a part is rotated, then mirrored left to right if it is on the bottom)
C0805 = smd 1.3 x 1.5: 1 -0.95,0; 2 0.95,0
SOD-123 = smd 0.91 x 1.22: A -1.65,0; C 1.65,0
JST-PH2.0-4-DUAL-I2C = drill 0.75: GND -1,0; SCL 1,0; SDA 3,0; VCC -3,0
JST-PH2.0-4-VERTICAL-I2C = drill 0.75: GND 1,0; SCL -1,0; SDA -3,0; VCC 3,0
RJ11-4-VERTICAL-I2C = drill 0.9: GND 0.635,4.58; SCL -0.635,7.12; SDA -1.905,4.58; VCC 1.905,7.12 | hole 3.25: -5.08,-1.77; 5.08,-1.77
RJ11-4-VERTICAL = drill 0.9: 1 -1.905,4.58; 2 -0.635,7.12; 3 0.635,4.58; 4 1.905,7.12 | hole 3.25: -5.08,-1.77; 5.08,-1.77
JST-PH2.0-3-VERTICAL-SIG = drill 0.75: + -2,0; - 0,0; SIG 2,0
JST-PH2.0-3-DUAL-SIG = drill 0.75: + 2,0; - 0,0; SIG -2,0
JST-PH2.0-5-DUAL-WEATHER = drill 0.75: DIR 0,0; GND 4,0; RAIN -2,0; SPD 2,0; VCC -4,0
JST-PH2.0-2-VERTICAL=POWER = drill 0.75: + -1,0; - 1,0
RJ11-6-VERTICAL-WIND = drill 0.9: DIR -0.635,7.12; GND 0.635,4.58; NC@1 -3.175,7.12; NC@6 3.175,4.58; SPD 1.905,7.12; VCC -1.905,4.58 | hole 3.25: -5.08,-1.77; 5.08,-1.77
RJ11-4-VERTICAL-RAIN = drill 0.9: 1 -1.905,4.58; 4 1.905,7.12; GND 0.635,4.58; SIG -0.635,7.12 | hole 3.25: -5.08,-1.77; 5.08,-1.77
CONN_04-I2C = drill 1 pad 1.524: GND 2.54,0; SCL 5.08,0; SDA 7.62,0; VCC 0,0
JST-PH2.0-2-HORIZONTAL-POWER = drill 0.75: + 1,0; - -1,0
R0805 = smd 1.3 x 1.5: 1 -0.95,0; 2 0.95,0
SWITCH-SPDT-PTH = drill 0.55: 1 -2.54,0; 2 0,0; 3 2.54,0

### Placement (x,y rotation side)
C1  25.4,34.91 180 bottom
C2  33.02,34.91 180 bottom
C3  40.64,34.91 180 bottom
C4  48.26,34.91 180 bottom
C5  55.88,34.91 180 bottom
C6  63.5,34.91 180 bottom
D1  25.4,27.92 180 bottom
D2  25.4,25.38 0 bottom
D3  33.02,27.92 180 bottom
D4  33.02,25.38 0 bottom
D5  40.64,27.92 180 bottom
D6  40.64,25.38 0 bottom
D7  48.26,27.92 180 bottom
D8  48.26,25.38 0 bottom
D9  55.88,27.92 180 bottom
D10  55.88,25.38 0 bottom
D11  63.5,27.92 180 bottom
D12  63.5,25.38 0 bottom
J1  3.81,39.35 90 bottom
J2  24.13,43.29 90 top
J3  35.56,47.61 0 top
J4  53.34,47.61 0 top
J5  64.77,43.29 270 top
J6  76.2,39.35 270 bottom
J7  76.2,19.03 270 bottom
J8  72.39,8.87 0 top
J9  53.34,9.51 180 top
J10  35.56,9.51 180 top
J11  16.51,22.21 270 top
J12  15.75,3.79 0 bottom
R1  25.4,31.1 180 bottom
R2  25.4,22.21 0 bottom
R3  33.02,31.1 180 bottom
R4  33.02,22.21 0 bottom
R5  40.64,31.1 180 bottom
R6  40.64,22.21 0 bottom
R7  48.26,31.1 180 bottom
R8  48.26,22.21 0 bottom
R9  55.88,31.1 180 bottom
R10  55.88,22.21 0 bottom
S1  70.87,1.89 0 top

### Tracks (layer width: path | path; a pad name or v marks a point on that pad's centre or on a via)
$X0
  cutout Bottom: 10.92,52.94 arc180 10.92,57 arc180
$X1
  cutout Bottom: 77.98,52.94 arc180 77.98,57 arc180
$X2
  cutout Bottom: 77.98,0.11 arc180 77.98,4.17 arc180
$X3
  cutout Bottom: 10.92,0.11 arc180 10.92,4.17 arc180
$X4
  cutout Top: 10.92,52.94 arc180 10.92,57 arc180
$X5
  cutout Top: 77.98,52.94 arc180 77.98,57 arc180
$X6
  cutout Top: 77.98,0.11 arc180 77.98,4.17 arc180
$X7
  cutout Top: 10.92,0.11 arc180 10.92,4.17 arc180
GND  (via drill 0.35)
  Bottom 0.406: C4.2 v50.8,34.91 | C3.2 v43.18,34.91 | C5.2 v58.42,34.91 | C6.2 v66.04,34.91 | C1.2 v27.94,34.91 | C2.2 v35.56,34.91 | D2.A v28.19,25.38 | D4.A v35.81,25.38 | D6.A v43.43,25.38 | D8.A v51.05,25.38 | D10.A v58.67,25.38 | D12.A v66.29,25.38
  pour Top (isolate 0.305, rank 2): 90.6,-1.82 90.6,58.97 -1.64,58.97 -1.64,-1.82
N$1  (via drill 0.35)
  Top 0.406: v50.8,22.21 52.07,23.48 73.76,23.48 J7.RAIN
  Bottom 0.406: R8.1 v50.8,22.21
N$2
  Bottom 0.406: J1.SCL 10.16,34 10.16,23.48 J11.SCL 21.91,17.13 26.35,21.57 R2.1
N$3
  Bottom 0.406: J1.SDA 3.18,42.35 1.91,41.08 1.91,36 8.26,29.65 8.26,22.21 15.88,14.59 J11.SDA 26.99,14.59 33.97,21.57 R4.1
N$4
  Bottom 0.406: J9.DIR 54.64,2.39 71.28,19.03 | C6.1 61.85,34.21 D11.A D12.C 61.85,24.93 67.75,19.03 71.28,19.03 | J7.DIR 71.28,19.03
  pour Bottom: 67.74,19.03 68.83,17.94 68.83,16.59 71.27,19.03
N$5  (via drill 0.35)
  Top 0.406: v58.42,22.21 71.03,22.21 J7.SPD
  Bottom 0.406: v58.42,22.21 R10.1
N$7
  Bottom 0.406: C4.1 R7.1 46.61,30.4 D7.A D8.C 46.61,22.91 R8.2 47.31,14.14 38.1,4.93 J10.1 37.47,3.66 J10.SIG
N$8
  Bottom 0.406: J3.SDA 26.67,45.2 26.67,42.83 J2.SDA 29.51,34.91 C2.1 R3.1 31.37,30.4 D3.A D4.C 31.37,23.22 31.44,23.16 31.44,22.84 R4.2
N$9  (via drill 0.35)
  Top 0.406: J6.SIG 73.62,38.72 59.69,38.72 v43.18,22.21
  Bottom 0.406: R6.1 v43.18,22.21
N$11
  Bottom 0.406: J3.SCL 34.11,54.73 25.4,46.34 25.4,43.56 J2.SCL 22.86,41.02 22.86,36.5 C1.1 R1.1 23.75,30.4 D1.A D2.C 23.75,22.91 R2.2
N$14
  Top 0.61: J12.- 18.02,2.52 25.64,2.52 31.35,8.24 62.47,8.24 64.37,10.14 72.12,10.14 J8.- 73.39,4.41 S1.2
N$15
  Bottom 0.406: R6.2 38.99,22.91 D6.C D5.A 38.99,30.4 R5.1 C3.1 39.69,41.08 50.17,51.55 50.17,52.82 52.07,54.73 J4.2 53.21,54.73 63.5,44.43 63.5,42.56 J5.SIG
N$16
  Top 0.61: J12.+ 17.29,1.25 26.22,1.25 31.99,6.97 63.14,6.97 65.04,8.87 J8.+ 71.39,4.95 S1.1
N$29
  Bottom 0.406: J9.SPD 52.1,2.39 53.99,4.28 53.99,21.65 54.93,22.59 R10.2 54.23,22.91 D10.C D9.A 54.23,30.4 R9.1 C5.1
VCC
  pour Bottom (isolate 0.305, rank 5): 89.6,-0.82 89.6,57.97 -0.64,57.97 -0.64,-0.82

### Text on the board
Bottom: v3.2
tPlace: digitalconcepts.net.au | 10068-WS v3.2
bPlace: S/N | 1 | 2 | 3 | 4
tNames: VCC | GND | SCL | SDA | Switch | ON
bNames: I2C | Wind | I2C [OUT] | Aux | Rain | Aux [OUT] | SCL | SDA | Speed | Dir'n | Wind/Rain [OUT]